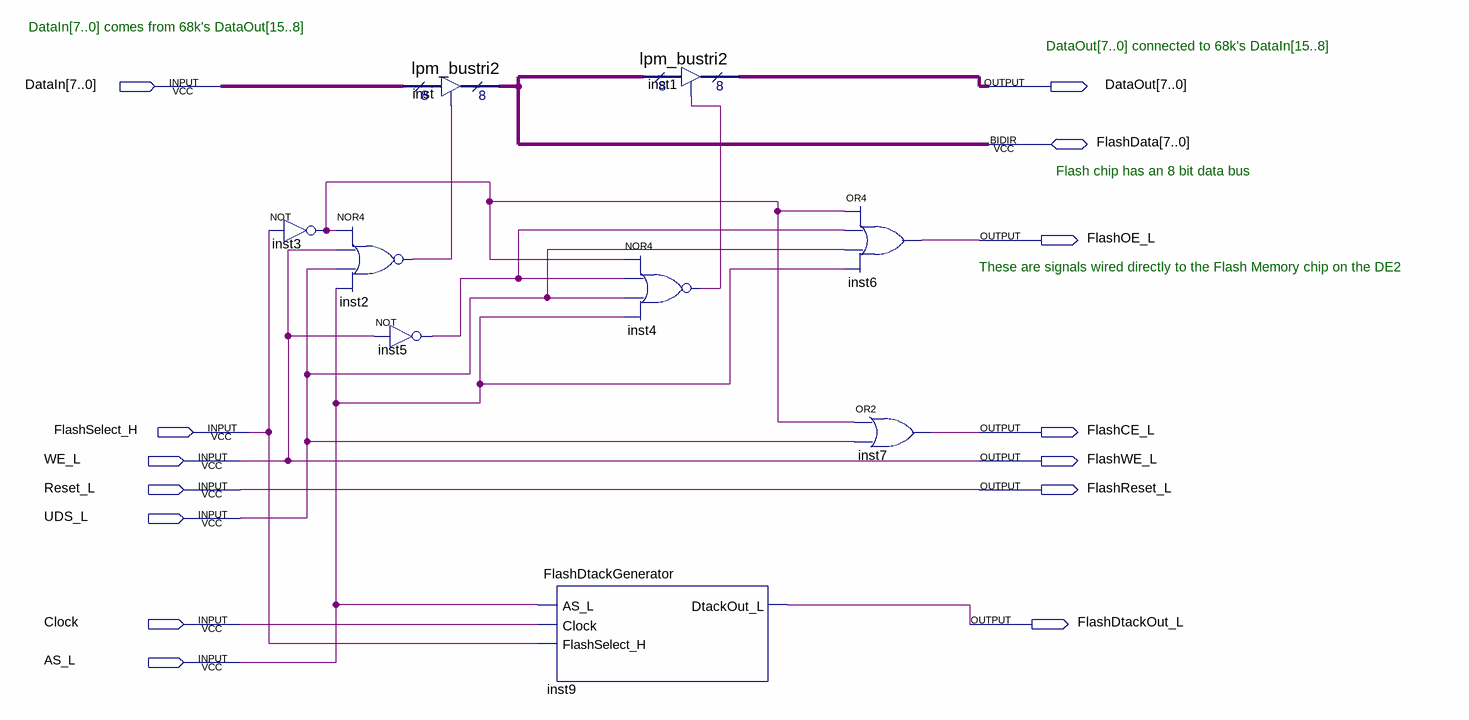
[diagram p0: schematic sheet]
// Quartus schematic FlashInterface.bdf as structural Verilog: 9 symbols, 14 pins
module FlashInterface (
  input  [7:0] DataIn,
  input  FlashSelect_H,
  input  WE_L,
  input  Reset_L,
  input  UDS_L,
  input  Clock,
  input  AS_L,
  inout  [7:0] FlashData,
  output [7:0] DataOut,
  output FlashOE_L,
  output FlashCE_L,
  output FlashWE_L,
  output FlashReset_L,
  output FlashDtackOut_L
);

  wire inst2_out, inst3_out, inst4_out, inst5_out;

  nor inst2 (inst2_out, inst3_out, WE_L, UDS_L, AS_L);
  not inst3 (inst3_out, FlashSelect_H);
  lpm_bustri2 inst (.enabledt(inst2_out), .data(DataIn), .tridata(FlashData));
  not inst5 (inst5_out, WE_L);
  FlashDtackGenerator inst9 (.AS_L(AS_L), .Clock(Clock), .FlashSelect_H(FlashSelect_H), .DtackOut_L(FlashDtackOut_L));
  lpm_bustri2 inst1 (.enabledt(inst4_out), .data(FlashData), .tridata(DataOut));
  nor inst4 (inst4_out, inst3_out, inst5_out, UDS_L, AS_L);
  or inst6 (FlashOE_L, inst3_out, inst5_out, UDS_L, AS_L);
  or inst7 (FlashCE_L, inst3_out, UDS_L);

  assign FlashReset_L = Reset_L;
  assign FlashWE_L = WE_L;

  // Notes on the sheet:
  //   DataIn[7..0] comes from 68k's DataOut[15..8]
  //   DataOut[7..0] connected to 68k's DataIn[15..8]
  //   Flash chip has an 8 bit data bus
  //   These are signals wired directly to the Flash Memory chip on the DE2
endmodule
